# EAGLE design electric-imp-breakout (EAGLE 6.6.0)
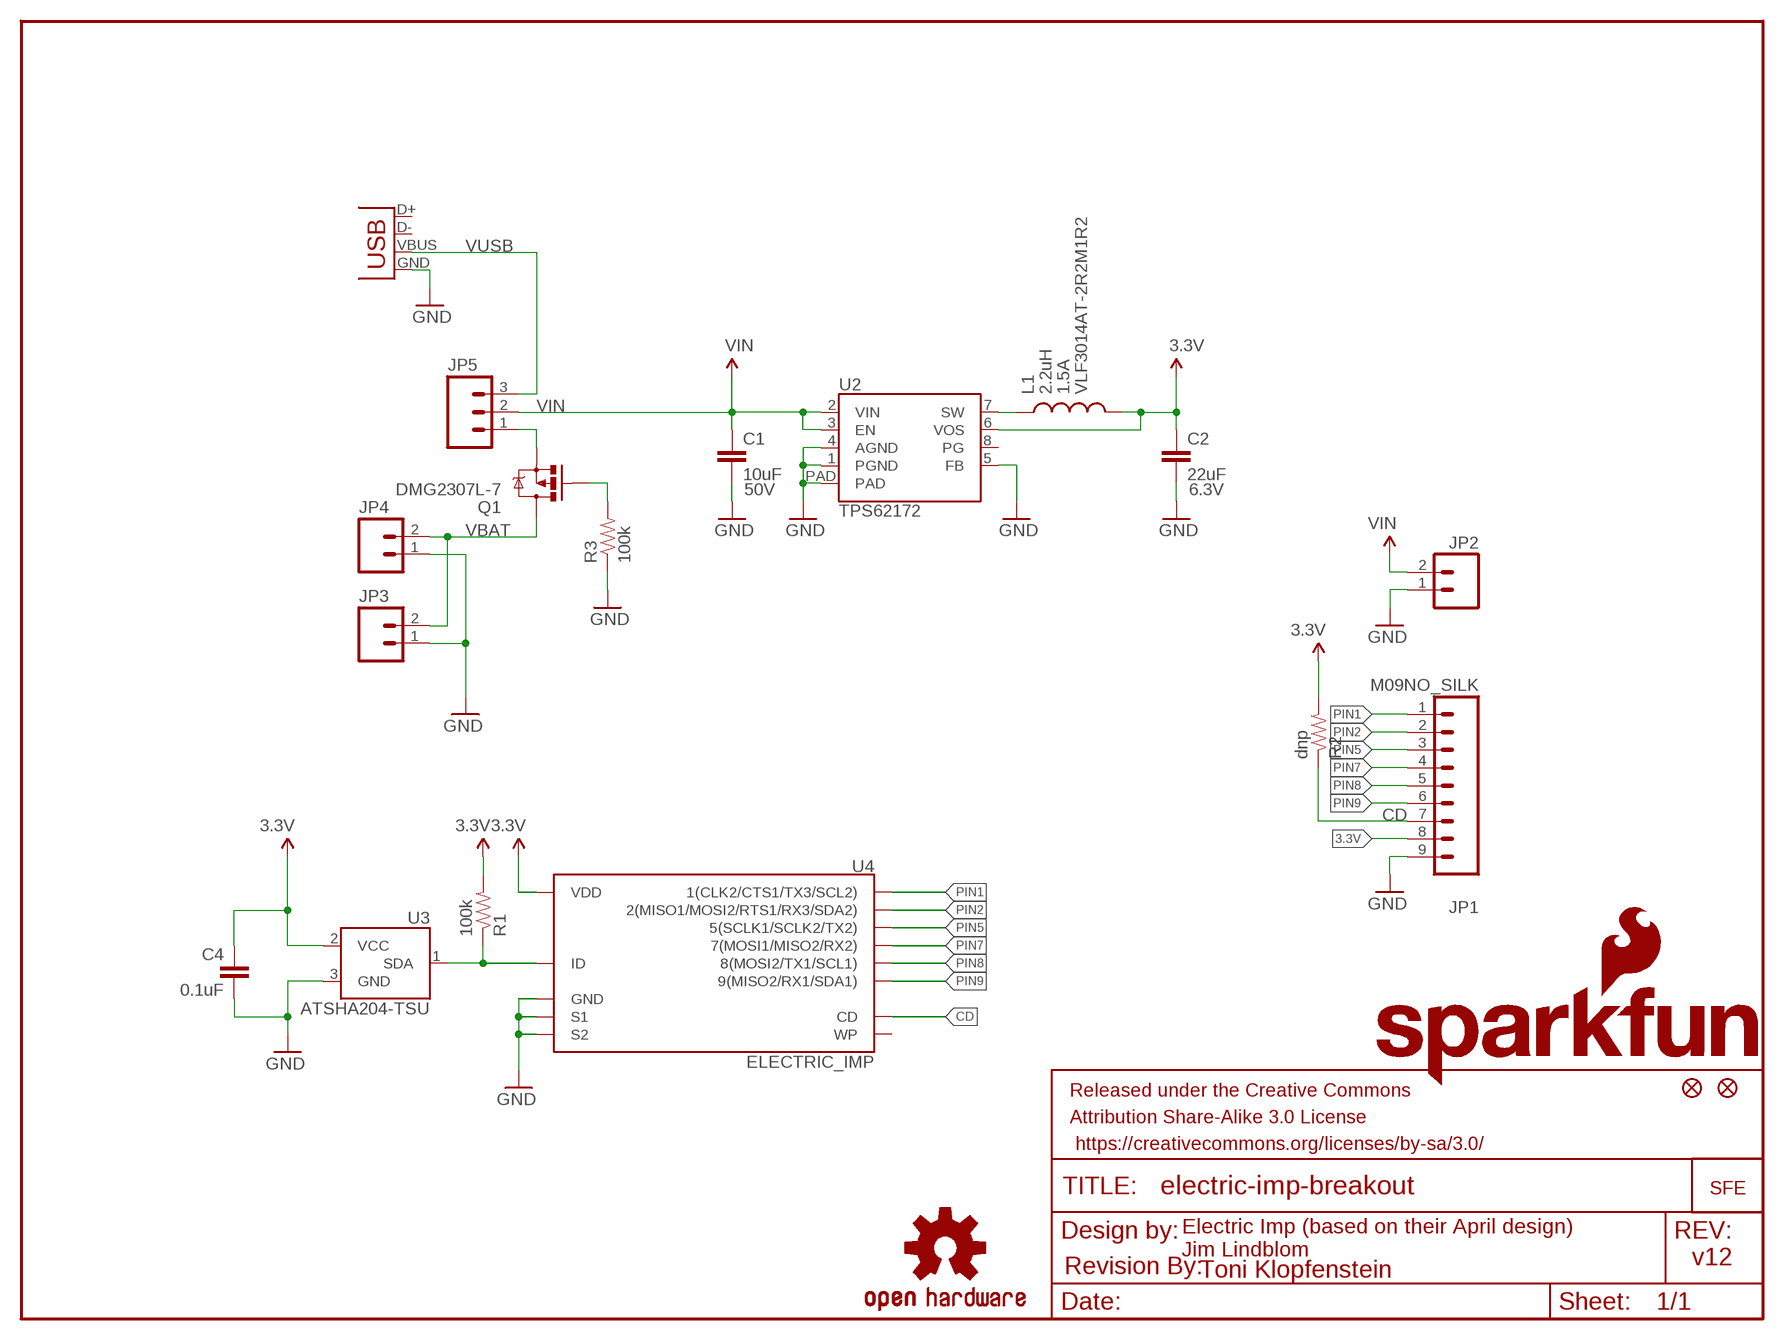
[diagram p0: schematic, sheet 1]

## Parts
C1  10uF  10UF50V20%(1210)  [1210]
C2  22uF  22UF-6.3V-20%(0805)  [0805]
C4  0.1uF  0.1UF-25V(+80/-20%)(0603)  [0603-CAP]
FID1  FIDUCIAL1X2  [FIDUCIAL-1X2]
FID2  FIDUCIAL1X2  [FIDUCIAL-1X2]
FRAME1  FRAME-LETTER  [CREATIVE_COMMONS]
JP1  M09NO_SILK  [1X09_NO_SILK]
JP2  M021X02_NO_SILK  [1X02_NO_SILK]
JP3  M02SMD  [1X02_SMD]
JP4  M02-JST-2-PTH-NO_SILK  [JST-2-PTH-NS]
JP5  M031X03_NO_SILK  [1X03_NO_SILK]
JP6  LOGO-SFESK  [SFE-LOGO-FLAME]
JP7  SFE_LOGO_NAME_FLAME.1_INCH  [SFE_LOGO_NAME_FLAME_.1]
L1  2.2uH  INDUCTORVLF4012A  [VLF4012A]
Q1  DMG2307L-7  MOSFET-PCHANNELSMD  [SOT23-3]
R1  100k  100KOHM1/10W1%(0603)  [0603-RES]
R2  dnp  RESISTOR0603  [0603-RES]
R3  100k  100KOHM1/10W1%(0603)  [0603-RES]
U2  TPS62172  [WSON-8-PAD]
U3  ATSHA204-TSU  [SOT23-3]
U4  ELECTRIC_IMP  [SD_1:1]
U$3  REVISION  [REVISION]
U$5  OSHW-LOGOS  [OSHW-LOGO-S]
X1  USBSMD  [USB-MINIB]

## Nets
3.3V: C2.1 C4.1 JP1.8 L1.P$2 R1.2 R2.2 U2.6(VOS) U3.2(VCC) U4.4(VDD)
CD: JP1.7 R2.1 U4.CD
GND: C1.2 C2.2 C4.2 JP1.9 JP2.1 JP3.1 JP4.1 R3.1 U2.1(PGND) U2.4(AGND) U2.5(FB) U2.PAD U3.3(GND) U4.3(GND) U4.SH@1(S1) U4.SH@2(S2) X1.GND
ID: R1.1 U3.1(SDA) U4.6(ID)
N$1: L1.P$1 U2.7(SW)
N$2: Q1.1(G) R3.2
N$6: JP5.1 Q1.2(S)
PIN1: JP1.1 U4.1(1(CLK2/CTS1/TX3/SCL2))
PIN2: JP1.2 U4.2(2(MISO1/MOSI2/RTS1/RX3/SDA2))
PIN5: JP1.3 U4.5(5(SCLK1/SCLK2/TX2))
PIN7: JP1.4 U4.7(7(MOSI1/MISO2/RX2))
PIN8: JP1.5 U4.8(8(MOSI2/TX1/SCL1))
PIN9: JP1.6 U4.9(9(MISO2/RX1/SDA1))
VBAT: JP3.2 JP4.2 Q1.3(D)
VIN: C1.1 JP2.2 JP5.2 U2.2(VIN) U2.3(EN)
VUSB: JP5.3 X1.VBUS
Unconnected: U2.8(PG) U4.WP X1.D+ X1.D-

## Notes on the sheet
- 1.5A | VLF3014AT-2R2M1R2
- 50V | 6.3V
- Electric Imp (based on their April design)
  Jim Lindblom
- v12
- Toni Klopfenstein

## Library data of the parts
C1 = SparkFun-Capacitors:10UF50V20%(1210): CAP-09824; PROD_ID: CAP-09824
C2 = SparkFun-Capacitors:22UF-6.3V-20%(0805): CAP-08402 Ceramic; PROD_ID: CAP-08402
C4 = SparkFun-Capacitors:0.1UF-25V(+80/-20%)(0603): CAP-00810 Ceramic Standard decoupling cap; PROD_ID: CAP-00810
FID1 FID2 = SparkFun-Aesthetics:FIDUCIAL: Fiducial Alignment Points Various fiducial points for machine vision alignment.
FRAME1 = SparkFun-Retired:FRAME-LETTER: Schematic Frame Standard 8.5x11 US Letter frame
JP1 = SparkFun-Connectors:M09: Header 9 Standard 9-pin 0.1" header. Use with straight break away headers (SKU : PRT-00116), right angle break away headers (PRT-00553), swiss pins (PRT-00743), machine pins (PRT-00117), and female headers (PRT-00115).
JP2-JP4 = SparkFun-Connectors:M02: Header 2 Standard 2-pin 0.1" header. Use with straight break away headers (SKU : PRT-00116), right angle break away headers (PRT-00553), swiss pins (PRT-00743), machine pins (PRT-00117), and female headers (PRT-00115). Molex polarized connector foot print use with SKU : PRT-08233 with associated crimp pins and housings.
JP5 = SparkFun-Connectors:M03: Header 3 Standard 3-pin 0.1" header. Use with straight break away headers (SKU : PRT-00116), right angle break away headers (PRT-00553), swiss pins (PRT-00743), machine pins (PRT-00117), and female headers (PRT-00115). Molex polarized connector foot print use with SKU : PRT-08232 with associated crimp pins and housings.
JP6 = SparkFun-Aesthetics:LOGO-SFE: Spark Fun Electronics PCB Logo This is the standard Spark Fun Electronics PCB logo.
JP7 = SparkFun-Aesthetics:SFE_LOGO_NAME_FLAME: SFE Logo, name and flame This is the SparkFun full logo. The logo on the schematic will always be the same size; the package variant is the height of the flame part of the logo. Default layer for the logo on the board is tSilk.
L1 = SparkFun-Passives:INDUCTOR: Inductors Basic Inductor/Choke - 0603 and 1206. Footprints are not proven and vary greatly between part numbers.
Q1 = SparkFun-DiscreteSemi:MOSFET-PCHANNEL: Generic PMOSFET
R1 R3 = SparkFun-Resistors:100KOHM1/10W1%(0603): RES-07828; PROD_ID: RES-07828
R2 = SparkFun-Resistors:RESISTOR: Resistor Basic schematic elements and footprints for 0603, 1206, and PTH resistors.
U2 = SparkFun-PowerIC:TPS62172
U3 = SparkFun-DigitalIC:ATSHA204
U4 = SparkFun-RF:ELECTRIC_IMP: Electric Imp SD Socket This symbol matches the Electric Imp <https://www.sparkfun.com/products/11395> pinout to a 4UCONN SD MMC connector. The 4UCONN part number is 19646 <http://www.4uconnector.com/online/Itemadrawing.asp?fldseries=19646&seriesno_a=12>. See this part in action on the Electric Imp Breakout <https://www.sparkfun.com/products/11400>.; PROD_ID: CONN-11976
U$3 = SparkFun-Aesthetics:REVISION
U$5 = SparkFun-Aesthetics:OSHW-LOGO: Open Source Hardware Logo This logo indicates the piece of hardware it is found on incorporates a OSHW license and/or adheres to the definition of open source hardware found here: http://freedomdefined.org/OSHW
X1 = SparkFun-Connectors:USB: USB Connectors USB-B-PTH is fully proven SKU : PRT-00139 USB-miniB is fully proven SKU : PRT-00587 USB-A-PCB is untested. USB-A-H is throughly reviewed, but untested. Spark Fun Electronics SKU : PRT-00437 USB-B-SMT is throughly reviewed, but untested. Needs silkscreen touching up. USB-A-S has not been used/tested USB-MB-H has not been used/tested

## Board
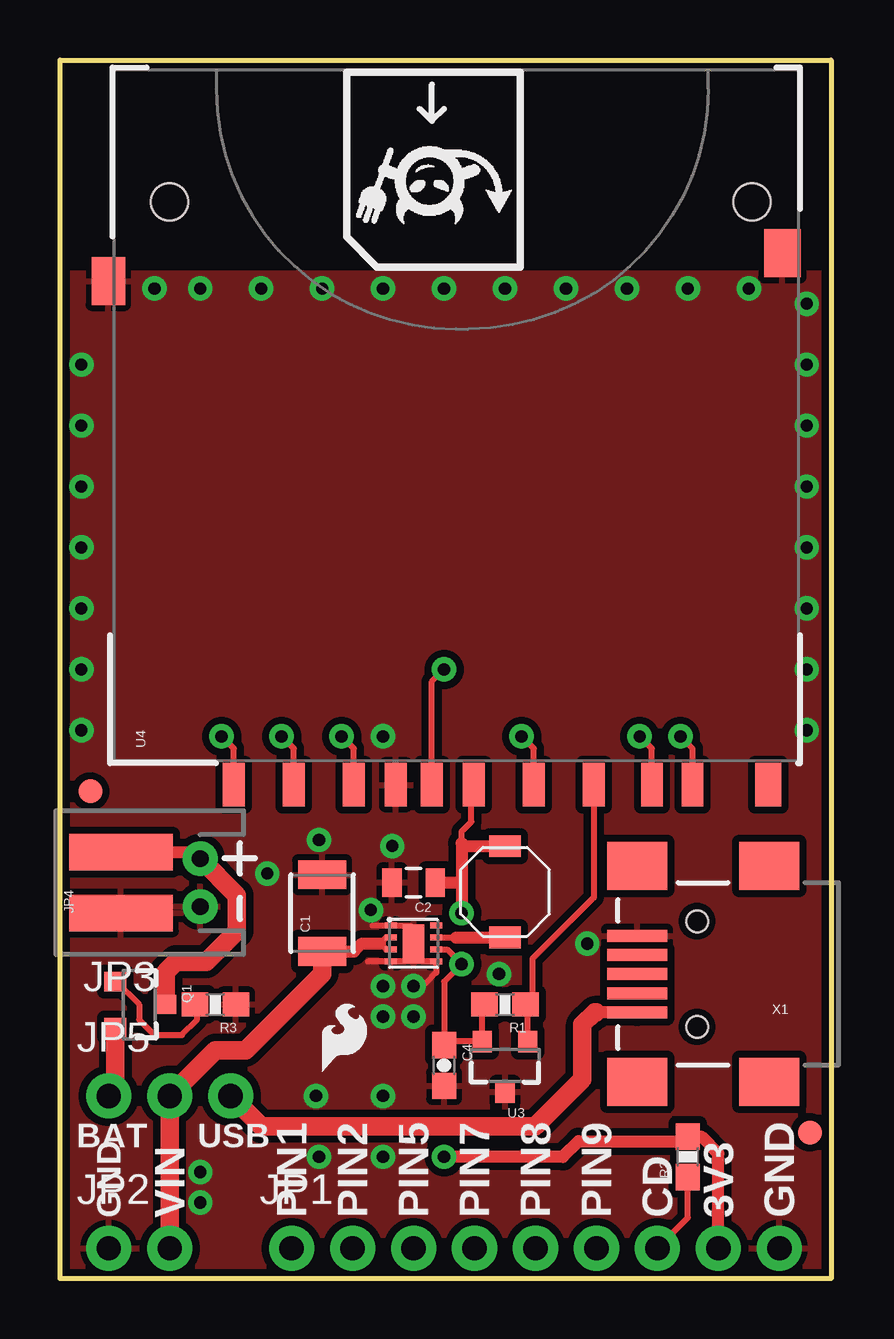
[diagram p1: board, top side]
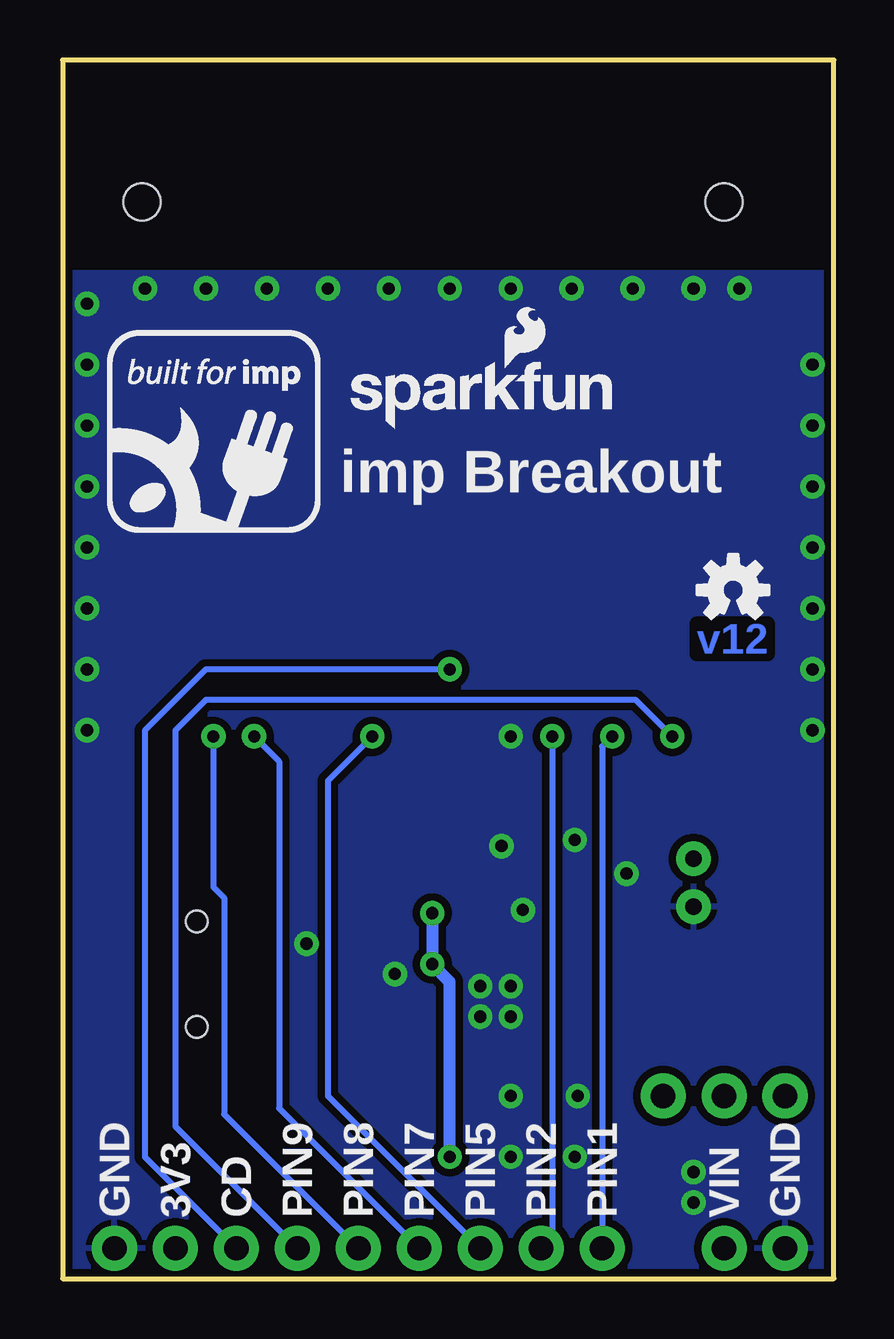
[diagram p2: board, bottom side, seen from below]

Size 32.13 x 50.8 mm. Coordinates in mm from the lower left corner, seen from the top.
Outline: 0,0 0,50.8 32.13,50.8 32.13,0 0,0
Copper layers (1*16): Top 0.035mm / dielectric 1.5mm / Bottom 0.035mm
Design rules "SparkFun-2-layer": minimum track width 7mil, minimum drill 15mil, track to track 8mil, track to pad 8mil, pad to pad 8mil, via to via 8mil, smd to smd 8mil, copper to edge 8mil, drill to drill 8mil, minimum pad ring 12mil, minimum via ring 10mil, stop-mask expansion 4mil, vias tented up to drill 20mil, thermal gap 10mil

### Footprints (pad centres in the part's own frame; a part is rotated, then mirrored left to right if it is on the bottom)
1210 = smd 1.2 x 2: 1 -1.6,0; 2 1.6,0
0805 = smd 0.8 x 1.2: 1 -0.9,0; 2 0.9,0
0603-CAP = smd 1.1 x 1: 1 -0.85,0; 2 0.85,0
FIDUCIAL-1X2 = smd 1 x 1: 1 0,0
1X09_NO_SILK = drill 1.016 pad 1.88: 1 0,0; 2 2.54,0; 3 5.08,0; 4 7.62,0; 5 10.16,0; 6 12.7,0; 7 15.24,0; 8 17.78,0; 9 20.32,0
1X02_NO_SILK = drill 1.016 pad 1.88: 1 0,0; 2 2.54,0
1X02_SMD = smd 4.318 x 1.524: 1 0,1.27; 2 0,-1.27
JST-2-PTH-NS = drill 0.7 pad 1.448: 1 -1,0; 2 1,0
1X03_NO_SILK = drill 1.016 pad 1.88: 1 0,0; 2 2.54,0; 3 5.08,0
VLF4012A = smd 0.9 x 1.3: P$1 -1.9,0; P$2 1.9,0
SOT23-3 = smd 0.8 x 0.9: 1 -0.95,-1; 2 0.95,-1; 3 0,1.1
0603-RES = smd 1.1 x 1: 1 -0.85,0; 2 0.85,0
WSON-8-PAD = smd 0.25 x 0.5: 1 -0.75,-0.95; 2 -0.25,-0.95; 3 0.25,-0.95; 4 0.75,-0.95; 5 0.75,0.95; 6 0.25,0.95; 7 -0.25,0.95; 8 -0.75,0.95 | smd 1.6 x 0.9: PAD 0,0
SD_1:1 = smd 1.8 x 0.9: 1 -1,6.77; 2 -1,4.27; 3 -1,2.52; 4 -1,-0.73; 5 -1,-3.23; 6 -1,-5.73; 7 -1,-8.15; 8 -1,-9.85; 9 -1,9.27; CD -1,1.02 | smd 2 x 1.4: SH@1 20,14.496 | smd 2 x 1.527: SH@2 21.15,-13.589 | smd 1.8 x 1.1: WP -1,-13 | hole 1.55: 23.3,11.94; 23.3,-12.32
USB-MINIB = smd 2.5 x 0.5: D+ 2.5,0; D- 2.5,0.8; GND 2.5,-1.6; ID 2.5,-0.8; VBUS 2.5,1.6 | smd 2.5 x 2: MTN1 -3,4.5; MTN2 2.5,4.5; MTN3 -3,-4.5; MTN4 2.5,-4.5 | hole 0.9: 0,2.2; 0,-2.2

### Placement (x,y rotation side)
C1  10.92,15.24 90 top
C2  14.73,16.51 180 top
C4  16,8.89 270 top
FID1  1.27,20.32 0 top
FID2  31.24,6.1 0 top
FRAME1  -2.7,-8.89 0 top  (outside the outline)
JP1  9.65,1.27 0 top
JP2  2.03,1.27 0 top
JP3  2.54,16.51 180 top
JP4  5.84,16.51 90 top
JP5  2.03,7.62 0 top
JP6  10.92,8.64 0 top
JP7  20.57,35.31 0 bottom
L1  18.54,16.13 90 top
Q1  3.3,11.43 270 top
R1  18.54,11.43 180 top
R2  26.16,5.08 90 top
R3  6.48,11.43 180 top
U2  14.73,13.97 270 top
U3  18.54,8.89 180 top
U4  16.51,21.59 90 top
U$3  8.89,-13.97 0 top  (outside the outline)
U$5  4.19,28.7 0 bottom
X1  26.54,12.7 180 top

### Tracks (layer width: path | path; a pad name or v marks a point on that pad's centre or on a via)
3.3V  (via drill 0.51)
  Top 0.254: U2.6 16.12,13.72 v16.73,13.11 16,12.38 C4.1 16.15,9.89 U3.2 17.59,11.33 R1.2 | 16.73,18.16 16.73,18.64 17.14,19.05 17.14,20.5 U4.4
  Top 0.508: 16.73,16.51 16.73,18.16 16.86,18.03 L1.P$2 | 16.73,16.51 v16.73,15.24 | v16,5.08 20.95,5.08 21.61,5.73 25.96,5.73 R2.2 26.71,5.93 27.43,5.21 JP1.8 | C2.1 16.73,16.51
  Bottom 0.508: v16,5.08 16,12.38 v16.73,13.11 v16.73,15.24
CD  (via drill 0.51)
  Top 0.254: JP1.7 26.16,2.54 R2.1 | U4.CD 15.49,24.89 v16,25.4
  Bottom 0.254: v16,25.4 26.16,25.4 28.7,22.86 28.7,5.08 JP1.7
GND  (via drill 0.51)
  Top 0.254: 13.02,14.72 U2.1 | 13.83,14.72 U2.1 | U2.5 15.68,12.76 15.24,12.32 | 12.84,13.22 U2.4 U2.5 | U2.1 14.59,14.72
  other vias: 31.11,40.64 31.11,38.1 31.11,35.56 31.11,33.02 31.11,30.48 31.11,27.94 31.11,25.4 31.11,22.86 0.89,22.86 0.89,25.4 0.89,27.94 0.89,30.48 0.89,33.02 0.89,35.56 0.89,38.1 3.94,41.27 5.84,41.27 8.38,41.27 10.92,41.27 13.46,41.27 16,41.27 18.54,41.27 21.08,41.27 23.62,41.27 26.16,41.27 28.7,41.27 14.73,12.19 13.46,12.19 13.84,18.03 10.79,18.29 8.64,16.89 5.84,3.17 13.46,22.61 21.97,13.97 13.46,7.62 13.46,5.08 10.79,5.08 10.67,7.62 12.95,15.37 5.84,4.45 14.73,10.92 18.29,12.7 13.46,10.92
  pour Top (isolate 0.305, rank 6): 0,0 0,41.91 32.13,41.91 32.13,0
  pour Bottom (isolate 0.305, rank 6): 0,0 0,41.91 32.13,41.91 32.13,0
ID
  Top 0.254: U3.1 19.49,11.33 R1.1 19.68,11.72 19.68,13.34 22.24,15.89 U4.6
N$1
  Top 0.254: U2.7 16.51,14.22
  Top 0.508: 16.51,14.22 L1.P$1
N$2
  Top 0.254: Q1.1 2.35,12.38 3.3,11.43 3.3,10.79 3.94,10.16 5.08,10.16 5.71,10.79 5.71,11.34 R3.2
N$6
  Top 0.762: Q1.2 2.3,7.89 JP5.1
PIN1  (via drill 0.51)
  Top 0.254: U4.1 9.74,22.1 v9.23,22.61
  Bottom 0.254: v9.23,22.61 9.65,22.19 JP1.1
PIN2  (via drill 0.51)
  Top 0.254: U4.2 12.24,22.1 v11.73,22.61
  Bottom 0.254: v11.73,22.61 11.73,1.73 JP1.2
PIN5  (via drill 0.51)
  Top 0.254: U4.5 19.74,22.1 v19.23,22.61
  Bottom 0.254: v19.23,22.61 21.08,20.76 21.08,7.62 JP1.3
PIN7  (via drill 0.51)
  Top 0.254: U4.7 24.66,22.1 v24.15,22.61
  Bottom 0.254: v24.15,22.61 23.11,21.57 23.11,7.11 JP1.4
PIN8  (via drill 0.51)
  Top 0.254: U4.8 26.36,22.1 v25.85,22.61
  Bottom 0.254: 25.85,22.55 v25.85,22.61 25.85,16.33 25.4,15.88 25.4,6.86 JP1.5
PIN9  (via drill 0.51)
  Top 0.254: U4.9 7.24,22.1 v6.73,22.61
  Bottom 0.254: v6.73,22.61 8.26,24.13 26.16,24.13 27.43,22.86 27.43,6.35 JP1.6
VBAT
  Top 0.508: JP3.2 5.59,17.78 5.86,17.51 JP4.2
  Top 0.762: JP4.2 7.37,15.99 7.37,14.48 6.1,13.21 4.83,13.21 4.4,12.78 Q1.3
VIN
  Top 0.254: U2.3 13.59,13.72 13.34,13.97 13.59,14.22 U2.2
  Top 0.508: C1.1 12.24,13.64 12.57,13.97 13.34,13.97
  Top 0.762: C1.1 10.92,12.7 7.75,9.53 6.48,9.53 JP5.2 JP2.2
VUSB
  Top 0.508: X1.VBUS 22.35,11.1
  Top 0.762: JP5.3 8.38,6.35 19.81,6.35 21.77,8.31 21.77,10.59 22.28,11.1 22.35,11.1

### Text on the board
Bottom: v12
tPlace: BAT | USB | GND | VIN | PIN1 | PIN2 | PIN5 | PIN7 | PIN8 | PIN9 | CD | 3V3 | GND
bPlace: imp Breakout | GND | VIN | PIN1 | PIN2 | PIN5 | PIN7 | PIN8 | PIN9 | CD | 3V3 | GND
tDocu: Electric Imp (based on their April design) | Jim Lindblom | Toni Klopfenstein
203bmp: //kentro/work/Eagle/Projects/SandBox/Jim/Electric Imp/built-for-imp16.bmp